# Altium project Booster_Main_Board.PrjPcb (part 4 of 4)
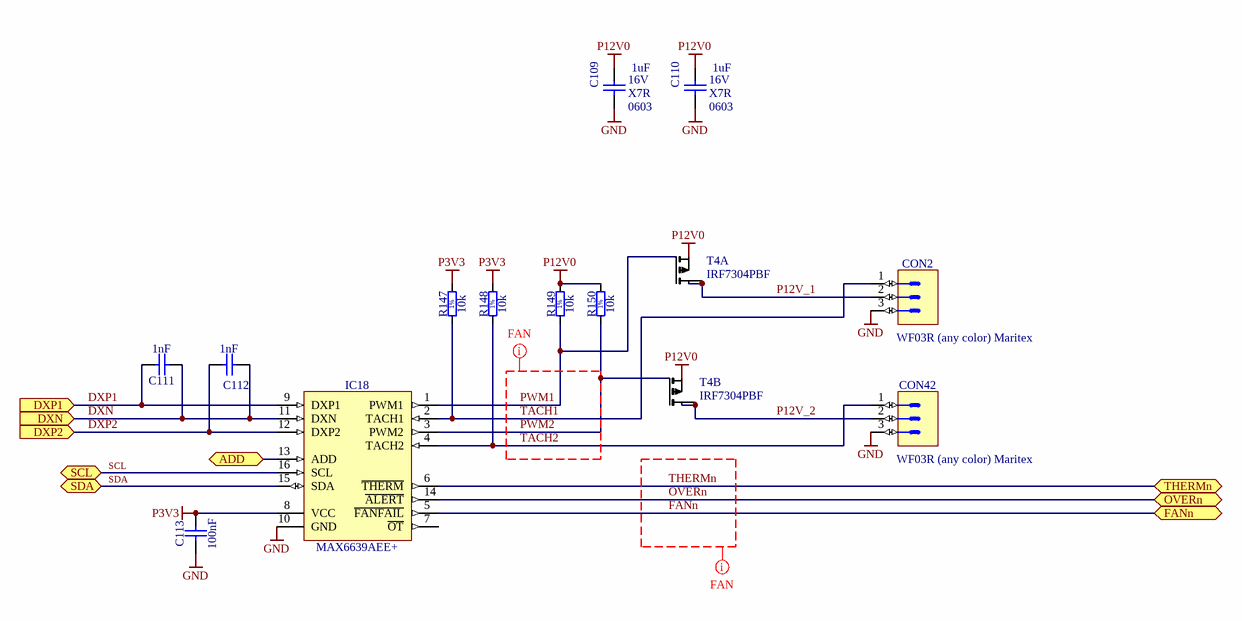
[diagram p5: TEMP_MGT.SchDoc]

## Nets that join several sheets
GND: Booster_TOP (27 pins), CPU (45 pins), U_PA_Channel (61 pins), U_PA_Channel (61 pins), U_PA_Channel (61 pins), U_PA_Channel (61 pins), U_PA_Channel (61 pins), U_PA_Channel (61 pins), U_PA_Channel (61 pins), U_PA_Channel (61 pins), Power_Supply (51 pins), U_TEMP_MGT (7 pins), U_TEMP_MGT (6 pins), U_TEMP_MGT (6 pins)
N8V0: U_PA_Channel (C42_1.2 IC13_1.2), U_PA_Channel (C42_2.2 IC13_2.2), U_PA_Channel (C42_3.2 IC13_3.2), U_PA_Channel (C42_4.2 IC13_4.2), U_PA_Channel (C42_5.2 IC13_5.2), U_PA_Channel (C42_6.2 IC13_6.2), U_PA_Channel (C42_7.2 IC13_7.2), U_PA_Channel (C42_8.2 IC13_8.2), Power_Supply (C31.2 L4.2 R91.2 R108.1)
P3V3: Booster_TOP (36 pins), CPU (38 pins), U_PA_Channel (18 pins), U_PA_Channel (18 pins), U_PA_Channel (18 pins), U_PA_Channel (18 pins), U_PA_Channel (18 pins), U_PA_Channel (18 pins), U_PA_Channel (18 pins), U_PA_Channel (18 pins), Power_Supply (13 pins), U_TEMP_MGT (C113_1.2 IC18_1.8 R147_1.2 R148_1.2), U_TEMP_MGT (C113_2.2 IC18_2.8 R147_2.2 R148_2.2), U_TEMP_MGT (5 pins)
P5V0: U_PA_Channel (F1_1.1), U_PA_Channel (F1_2.1), U_PA_Channel (F1_3.1), U_PA_Channel (F1_4.1), U_PA_Channel (F1_5.1), U_PA_Channel (F1_6.1), U_PA_Channel (F1_7.1), U_PA_Channel (F1_8.1), Power_Supply (C22.2 IC4.1 IC4.2 R21.1)
P6V5: U_PA_Channel (C78_1.1 IC3_1.2), U_PA_Channel (C78_2.1 IC3_2.2), U_PA_Channel (C78_3.1 IC3_3.2), U_PA_Channel (C78_4.1 IC3_4.2), U_PA_Channel (C78_5.1 IC3_5.2), U_PA_Channel (C78_6.1 IC3_6.2), U_PA_Channel (C78_7.1 IC3_7.2), U_PA_Channel (C78_8.1 IC3_8.2), Power_Supply (9 pins)
P12V0: Power_Supply (11 pins), U_TEMP_MGT (6 pins), U_TEMP_MGT (6 pins), U_TEMP_MGT (6 pins)
P30V0: U_PA_Channel (C32_1.2 R17_1.2 U1_1.1), U_PA_Channel (C32_2.2 R17_2.2 U1_2.1), U_PA_Channel (C32_3.2 R17_3.2 U1_3.1), U_PA_Channel (C32_4.2 R17_4.2 U1_4.1), U_PA_Channel (C32_5.2 R17_5.2 U1_5.1), U_PA_Channel (C32_6.2 R17_6.2 U1_6.1), U_PA_Channel (C32_7.2 R17_7.2 U1_7.1), U_PA_Channel (C32_8.2 R17_8.2 U1_8.1), Power_Supply (C63.2 FL1.2 R96.2 R110.2)
ADC_IN0: CPU (IC1.34), U_PA_Channel (C73_1.1 J1_1.5)
ADC_IN1: CPU (IC1.35), U_PA_Channel (C79_1.1 J1_1.10)
ADC_IN2: CPU (IC1.36), U_PA_Channel (C73_2.1 J1_2.5)
ADC_IN3: CPU (IC1.37), U_PA_Channel (C79_2.1 J1_2.10)
ADC_IN4: CPU (IC1.18), U_PA_Channel (C73_3.1 J1_3.5)
ADC_IN5: CPU (IC1.19), U_PA_Channel (C79_3.1 J1_3.10)
ADC_IN6: CPU (IC1.20), U_PA_Channel (C73_4.1 J1_4.5)
ADC_IN7: CPU (IC1.21), U_PA_Channel (C79_4.1 J1_4.10)
ADC_IN8: CPU (IC1.22), U_PA_Channel (C73_5.1 J1_5.5)
ADC_IN9: CPU (IC1.13), U_PA_Channel (C79_5.1 J1_5.10)
ADC_IN10: CPU (IC1.26), U_PA_Channel (C73_6.1 J1_6.5)
ADC_IN11: CPU (IC1.27), U_PA_Channel (C79_6.1 J1_6.10)
ADC_IN12: CPU (IC1.28), U_PA_Channel (C73_7.1 J1_7.5)
ADC_IN13: CPU (IC1.29), U_PA_Channel (C79_7.1 J1_7.10)
ADC_IN14: CPU (IC1.14), U_PA_Channel (C73_8.1 J1_8.5)
ADC_IN15: CPU (IC1.15), U_PA_Channel (C79_8.1 J1_8.10)
ALERT: CPU (IC1.77), U_PA_Channel (IC9_1.2 LD4_1.1 R57_1.1)
ALERT: CPU (IC1.78), U_PA_Channel (IC9_2.2 LD4_2.1 R57_2.1)
ALERT: CPU (IC1.79), U_PA_Channel (IC9_3.2 LD4_3.1 R57_3.1)
ALERT: CPU (IC1.80), U_PA_Channel (IC9_4.2 LD4_4.1 R57_4.1)
ALERT: CPU (IC1.81), U_PA_Channel (IC9_5.2 LD4_5.1 R57_5.1)
ALERT: CPU (IC1.82), U_PA_Channel (IC9_6.2 LD4_6.1 R57_6.1)
ALERT: CPU (IC1.85), U_PA_Channel (IC9_7.2 LD4_7.1 R57_7.1)
ALERT: CPU (IC1.86), U_PA_Channel (IC9_8.2 LD4_8.1 R57_8.1)
BOOT_SW: Booster_TOP (J2.1), CPU (R42.1)
DXN: Booster_TOP (J4.2), U_TEMP_MGT (C111_1.1 C112_1.1 IC18_1.11)
DXN: Booster_TOP (J4.5), U_TEMP_MGT (C111_2.1 C112_2.1 IC18_2.11)
DXN: Booster_TOP (J4.8), U_TEMP_MGT (C111_3.1 C112_3.1 IC18_3.11)
DXP1: Booster_TOP (J4.1), U_TEMP_MGT (C111_1.2 IC18_1.9)
DXP1: Booster_TOP (J4.4), U_TEMP_MGT (C111_2.2 IC18_2.9)
DXP1: Booster_TOP (J4.7), U_TEMP_MGT (C111_3.2 IC18_3.9)
DXP2: Booster_TOP (J4.3), U_TEMP_MGT (C112_1.2 IC18_1.12)
DXP2: Booster_TOP (J4.6), U_TEMP_MGT (C112_2.2 IC18_2.12)
DXP2: Booster_TOP (J4.9), U_TEMP_MGT (C112_3.2 IC18_3.12)
EN_PWR_CH0: CPU (IC1.114), U_PA_Channel (R85_1.2 R88_1.2)
EN_PWR_CH1: CPU (IC1.115), U_PA_Channel (R85_2.2 R88_2.2)
EN_PWR_CH2: CPU (IC1.116), U_PA_Channel (R85_3.2 R88_3.2)
EN_PWR_CH3: CPU (IC1.117), U_PA_Channel (R85_4.2 R88_4.2)
EN_PWR_CH4: CPU (IC1.118), U_PA_Channel (R85_5.2 R88_5.2)
EN_PWR_CH5: CPU (IC1.119), U_PA_Channel (R85_6.2 R88_6.2)
EN_PWR_CH6: CPU (IC1.122), U_PA_Channel (R85_7.2 R88_7.2)
EN_PWR_CH7: CPU (IC1.123), U_PA_Channel (R85_8.2 R88_8.2)
FANn: Booster_TOP (R24.2), CPU (IC1.45), U_TEMP_MGT (IC18_1.5), U_TEMP_MGT (IC18_2.5), U_TEMP_MGT (IC18_3.5)
FR_Q0: CPU (IC1.141), U_PA_Channel (C83_1.1 J1_1.1)
FR_Q1: CPU (IC1.142), U_PA_Channel (C83_2.1 J1_2.1)
FR_Q2: CPU (IC1.1), U_PA_Channel (C83_3.1 J1_3.1)
FR_Q3: CPU (IC1.2), U_PA_Channel (C83_4.1 J1_4.1)
FR_Q4: CPU (IC1.3), U_PA_Channel (C83_5.1 J1_5.1)
FR_Q5: CPU (IC1.4), U_PA_Channel (C83_6.1 J1_6.1)
FR_Q6: CPU (IC1.5), U_PA_Channel (C83_7.1 J1_7.1)
FR_Q7: CPU (IC1.58), U_PA_Channel (C83_8.1 J1_8.1)
I2C0_SCL: Booster_TOP (D7.2 IC11.2 R63.1), U_PA_Channel (C81_1.1 IC9_1.3 IC15_1.5 J1_1.9)
I2C0_SDA: Booster_TOP (D7.3 IC11.1 R61.1), U_PA_Channel (C80_1.1 IC9_1.4 IC15_1.4 J1_1.4)
I2C1_SCL: Booster_TOP (D8.2 IC11.4 R65.1), U_PA_Channel (C81_2.1 IC9_2.3 IC15_2.5 J1_2.9)
I2C1_SDA: Booster_TOP (D8.3 IC11.3 R64.1), U_PA_Channel (C80_2.1 IC9_2.4 IC15_2.4 J1_2.4)
I2C2_SCL: Booster_TOP (D9.2 IC11.6 R70.1), U_PA_Channel (C81_3.1 IC9_3.3 IC15_3.5 J1_3.9)
I2C2_SDA: Booster_TOP (D9.3 IC11.5 R68.1), U_PA_Channel (C80_3.1 IC9_3.4 IC15_3.4 J1_3.4)
I2C3_SCL: Booster_TOP (D10.2 IC11.8 R72.1), U_PA_Channel (C81_4.1 IC9_4.3 IC15_4.5 J1_4.9)
I2C3_SDA: Booster_TOP (D10.3 IC11.7 R71.1), U_PA_Channel (C80_4.1 IC9_4.4 IC15_4.4 J1_4.4)
I2C4_SCL: Booster_TOP (D11.2 IC11.11 R74.1), U_PA_Channel (C81_5.1 IC9_5.3 IC15_5.5 J1_5.9)
I2C4_SDA: Booster_TOP (D11.3 IC11.10 R73.1), U_PA_Channel (C80_5.1 IC9_5.4 IC15_5.4 J1_5.4)
I2C5_SCL: Booster_TOP (D14.2 IC11.13 R76.1), U_PA_Channel (C81_6.1 IC9_6.3 IC15_6.5 J1_6.9)
I2C5_SDA: Booster_TOP (D14.3 IC11.12 R75.1), U_PA_Channel (C80_6.1 IC9_6.4 IC15_6.4 J1_6.4)
I2C6_SCL: Booster_TOP (D12.2 IC11.15 R78.1), U_PA_Channel (C81_7.1 IC9_7.3 IC15_7.5 J1_7.9)
I2C6_SDA: Booster_TOP (D12.3 IC11.14 R77.1), U_PA_Channel (C80_7.1 IC9_7.4 IC15_7.4 J1_7.4)
I2C7_SCL: Booster_TOP (D13.2 IC11.17 R80.1), U_PA_Channel (C81_8.1 IC9_8.3 IC15_8.5 J1_8.9)
I2C7_SDA: Booster_TOP (D13.3 IC11.16 R79.1), U_PA_Channel (C80_8.1 IC9_8.4 IC15_8.4 J1_8.4)
I2C_SCL: Booster_TOP (IC11.19 J2.23 R62.2), CPU (IC1.136), U_TEMP_MGT (IC18_1.16), U_TEMP_MGT (IC18_2.16), U_TEMP_MGT (IC18_3.16)
I2C_SDA: Booster_TOP (IC11.20 J2.24 R60.2), CPU (IC1.137), U_TEMP_MGT (IC18_1.15), U_TEMP_MGT (IC18_2.15), U_TEMP_MGT (IC18_3.15)
I2C_SW_RSTn: Booster_TOP (IC11.24 R105.1), CPU (IC1.75)
Input_overdrive: CPU (IC1.59), U_PA_Channel (C82_1.1 J1_1.3 R34_1.1)
Input_overdrive: CPU (IC1.60), U_PA_Channel (C82_2.1 J1_2.3 R34_2.1)
Input_overdrive: CPU (IC1.63), U_PA_Channel (C82_3.1 J1_3.3 R34_3.1)
Input_overdrive: CPU (IC1.64), U_PA_Channel (C82_4.1 J1_4.3 R34_4.1)
Input_overdrive: CPU (IC1.65), U_PA_Channel (C82_5.1 J1_5.3 R34_5.1)
Input_overdrive: CPU (IC1.66), U_PA_Channel (C82_6.1 J1_6.3 R34_6.1)
Input_overdrive: CPU (IC1.67), U_PA_Channel (C82_7.1 J1_7.3 R34_7.1)
Input_overdrive: CPU (IC1.68), U_PA_Channel (C82_8.1 J1_8.3 R34_8.1)
NetD2_1_1: CPU (IC1.89), U_PA_Channel (D2_1.1), U_PA_Channel (D2_2.1), U_PA_Channel (D2_3.1), U_PA_Channel (D2_4.1), U_PA_Channel (D2_5.1), U_PA_Channel (D2_6.1), U_PA_Channel (D2_7.1), U_PA_Channel (D2_8.1), Power_Supply (5 pins)
NetIC1_40: Booster_TOP (J2.2), CPU (IC1.40)
NetIC1_41: Booster_TOP (J2.4), CPU (IC1.41)
NetIC1_42: Booster_TOP (J2.8), CPU (IC1.42)
NetIC1_43: Booster_TOP (J2.6), CPU (IC1.43)
NetIC1_73: Booster_TOP (J2.14), CPU (IC1.73)
NetIC1_74: Booster_TOP (J2.16), CPU (IC1.74)
NetIC1_76: Booster_TOP (J2.17), CPU (IC1.76)
NetIC1_90: Booster_TOP (J2.10), CPU (IC1.90)
NetIC1_91: Booster_TOP (J2.12), CPU (IC1.91)
NetIC1_102: Booster_TOP (J2.29), CPU (IC1.102)
NetIC1_103: Booster_TOP (J2.27), CPU (IC1.103)
NetIC1_104: Booster_TOP (J2.28), CPU (IC1.104)
NetIC1_139: Booster_TOP (J2.18), CPU (IC1.139)
NetJ2_26: Booster_TOP (J2.26), CPU (R3.2)
OVERn: Booster_TOP (R23.2), CPU (IC1.56), U_TEMP_MGT (IC18_1.14), U_TEMP_MGT (IC18_2.14), U_TEMP_MGT (IC18_3.14)
P2V5_REF: Booster_TOP (C52.1 IC10.2), CPU (FB2.2), U_PA_Channel (C51_1.1 IC9_1.15), U_PA_Channel (C51_2.1 IC9_2.15), U_PA_Channel (C51_3.1 IC9_3.15), U_PA_Channel (C51_4.1 IC9_4.15), U_PA_Channel (C51_5.1 IC9_5.15), U_PA_Channel (C51_6.1 IC9_6.15), U_PA_Channel (C51_7.1 IC9_7.15), U_PA_Channel (C51_8.1 IC9_8.15)
PA_CH_RESETn: CPU (IC1.140), U_PA_Channel (IC9_1.1), U_PA_Channel (IC9_2.1), U_PA_Channel (IC9_3.1), U_PA_Channel (IC9_4.1), U_PA_Channel (IC9_5.1), U_PA_Channel (IC9_6.1), U_PA_Channel (IC9_7.1), U_PA_Channel (IC9_8.1)
PA_SIG_GND: CPU (R83.2), U_PA_Channel (J1_1.15), U_PA_Channel (J1_2.15), U_PA_Channel (J1_3.15), U_PA_Channel (J1_4.15), U_PA_Channel (J1_5.15), U_PA_Channel (J1_6.15), U_PA_Channel (J1_7.15), U_PA_Channel (J1_8.15)
PGOOD_N7V5: CPU (IC1.57), Power_Supply (IC5.8 R25.2 TP1.1)
SIG_ON_CH0: CPU (IC1.93), U_PA_Channel (R50_1.1 R84_1.2)
SIG_ON_CH1: CPU (IC1.124), U_PA_Channel (R50_2.1 R84_2.2)
SIG_ON_CH2: CPU (IC1.125), U_PA_Channel (R50_3.1 R84_3.2)
SIG_ON_CH3: CPU (IC1.126), U_PA_Channel (R50_4.1 R84_4.2)
SIG_ON_CH4: CPU (IC1.127), U_PA_Channel (R50_5.1 R84_5.2)
SIG_ON_CH5: CPU (IC1.128), U_PA_Channel (R50_6.1 R84_6.2)
SIG_ON_CH6: CPU (IC1.129), U_PA_Channel (R50_7.1 R84_7.2)
SIG_ON_CH7: CPU (IC1.132), U_PA_Channel (R50_8.1 R84_8.2)
SWn1: Booster_TOP (J2.19), CPU (IC1.54 R112.1)
SWn2: Booster_TOP (J2.20), CPU (IC1.55 R113.1)
THERMn: Booster_TOP (R22.2), CPU (IC1.44), U_TEMP_MGT (IC18_1.6), U_TEMP_MGT (IC18_2.6), U_TEMP_MGT (IC18_3.6)